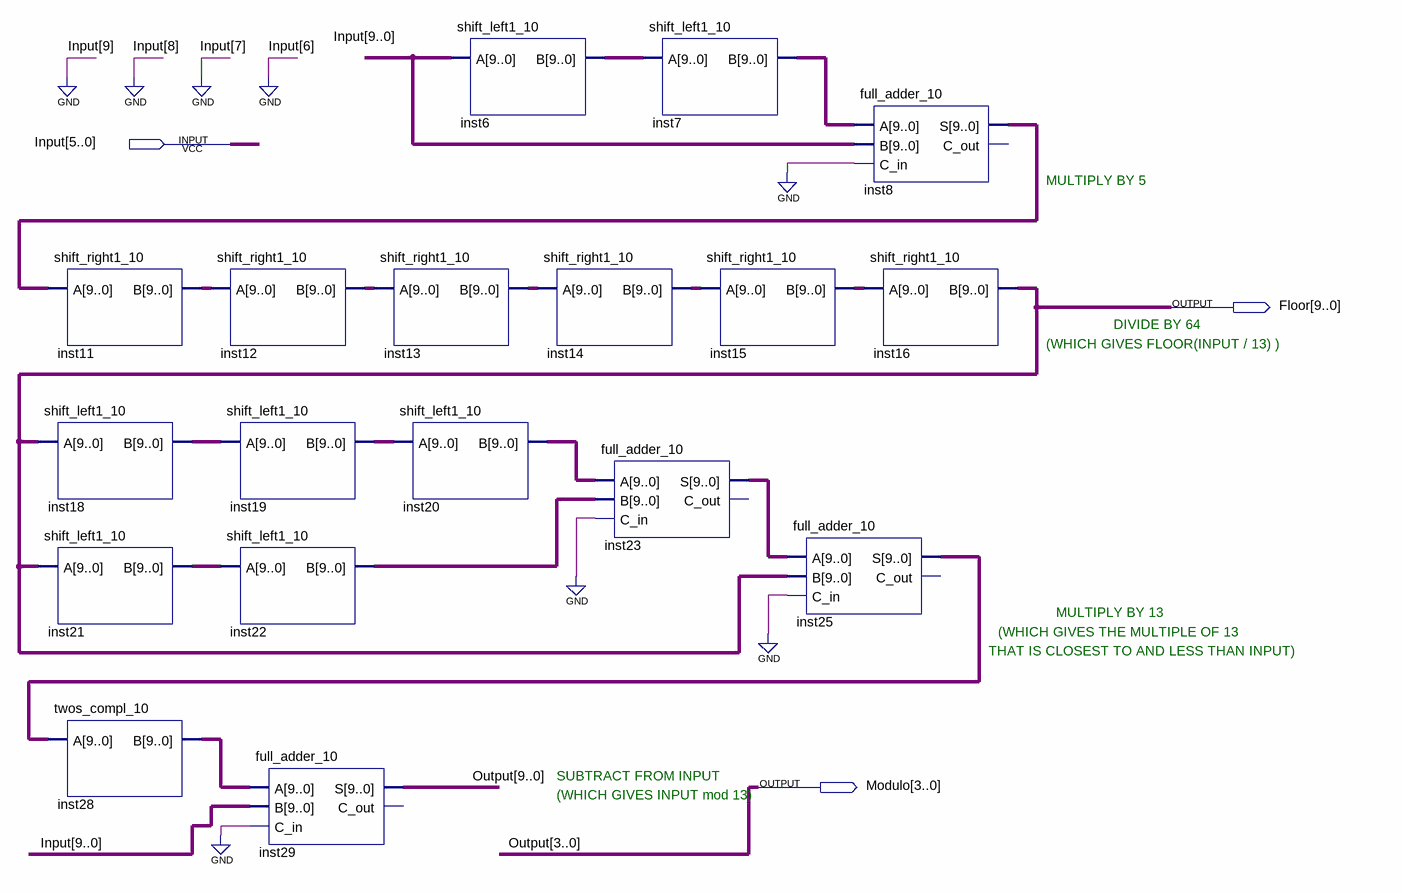
[diagram p0: schematic sheet]
// Quartus schematic g32_Amod13.bdf as structural Verilog: 18 symbols, 3 pins
module g32_Amod13 (
  input  [5:0] Input,
  output [9:0] Floor,
  output [3:0] Modulo
);

  wire [9:0] inst6_b, inst7_b, inst8_s, inst11_b, inst12_b, inst13_b, inst14_b, inst15_b, inst18_b, inst19_b,
       inst20_b, inst21_b, inst22_b, inst23_s, inst25_s, inst28_b;
  wire [9:4] Output;

  shift_right1_10 inst11 (.A(inst8_s), .B(inst11_b));
  shift_left1_10 inst18 (.A(Floor), .B(inst18_b));
  shift_left1_10 inst21 (.A(Floor), .B(inst21_b));
  twos_compl_10 inst28 (.A(inst25_s), .B(inst28_b));
  shift_right1_10 inst12 (.A(inst11_b), .B(inst12_b));
  shift_left1_10 inst19 (.A(inst18_b), .B(inst19_b));
  shift_left1_10 inst22 (.A(inst21_b), .B(inst22_b));
  full_adder_10 inst29 (.A(inst28_b), .B({4'b0000, Input}), .C_in(1'b0), .S({Output, Modulo}));  // open: C_out
  shift_right1_10 inst13 (.A(inst12_b), .B(inst13_b));
  shift_left1_10 inst6 (.A({4'b0000, Input}), .B(inst6_b));
  shift_left1_10 inst20 (.A(inst19_b), .B(inst20_b));
  shift_right1_10 inst14 (.A(inst13_b), .B(inst14_b));
  full_adder_10 inst23 (.A(inst20_b), .B(inst22_b), .C_in(1'b0), .S(inst23_s));  // open: C_out
  shift_left1_10 inst7 (.A(inst6_b), .B(inst7_b));
  shift_right1_10 inst15 (.A(inst14_b), .B(inst15_b));
  full_adder_10 inst25 (.A(inst23_s), .B(Floor), .C_in(1'b0), .S(inst25_s));  // open: C_out
  full_adder_10 inst8 (.A(inst7_b), .B({4'b0000, Input}), .C_in(1'b0), .S(inst8_s));  // open: C_out
  shift_right1_10 inst16 (.A(inst15_b), .B(Floor));

  // Other names for the same wires on the sheet: Output[3:0] = Modulo

  // Notes on the sheet:
  //   MULTIPLY BY 5
  //   DIVIDE BY 64
  //   (WHICH GIVES FLOOR(INPUT / 13) )
  //   MULTIPLY BY 13
  //   (WHICH GIVES THE MULTIPLE OF 13
  //   THAT IS CLOSEST TO AND LESS THAN INPUT)
  //   SUBTRACT FROM INPUT
  //   (WHICH GIVES INPUT mod 13)
endmodule
